# Altium schematic sheet ESP_SCH.SchDoc
size 840 x 594 mm; SheetNumber: 1; SheetTotal: 1; PageSetup: Record=PageOptions|CenterHorizontal=False|CenterVertical=False|PrintScale=0.33|XCorrection=0.00|YCorrection=0.00|PrintKind=1|BorderSize=5000000|LeftOffset=0|BottomOffset=0|Orientation=2|PaperLength=1000|PaperWidth=1000|Scale=100|PaperSource=15|PrintQuality=600|MediaType=1|DitherType=10|PrintScaleMode=1|PaperKind=Letter|PaperIndex=1; ЕСКД: 2.104-2006
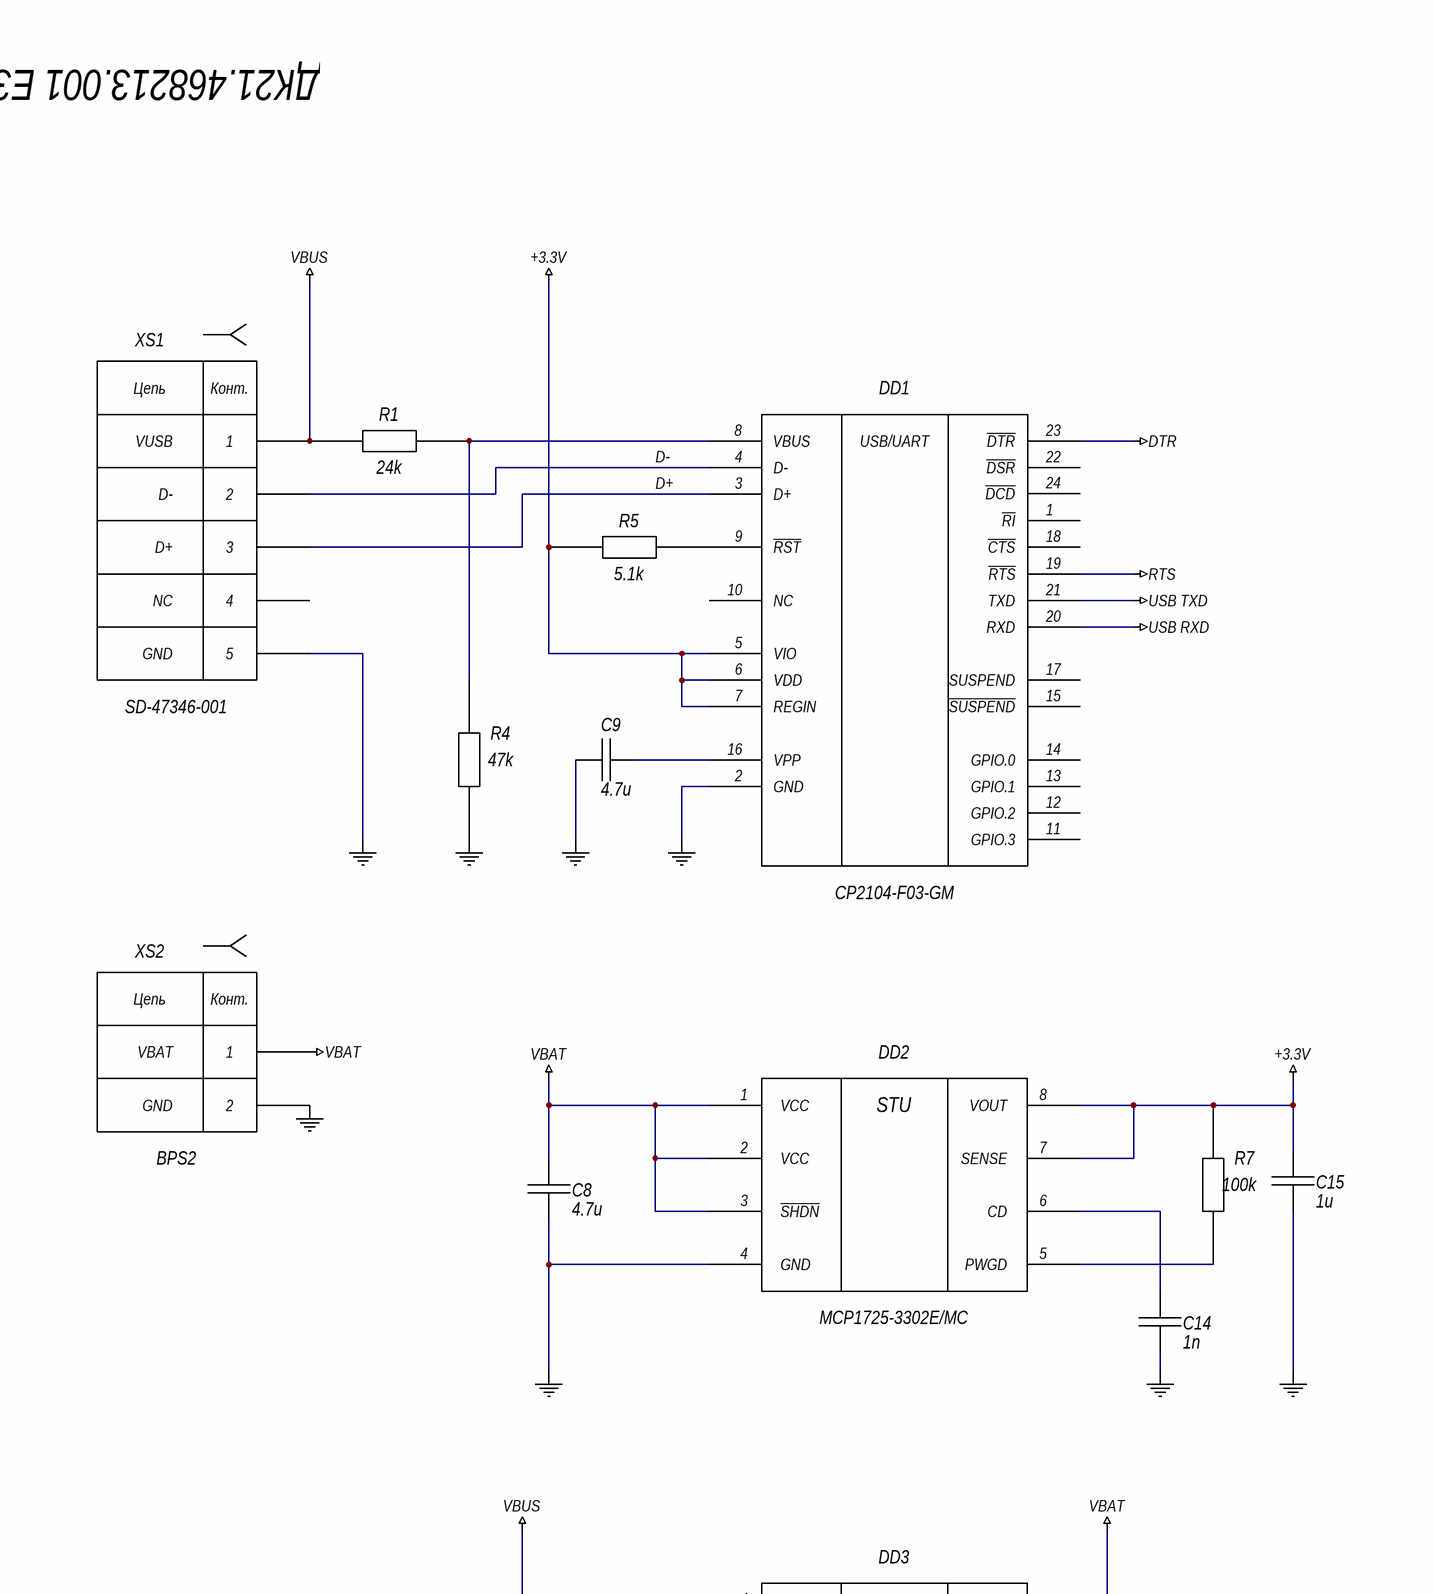
[diagram p0: ESP_SCH.SchDoc, top left]
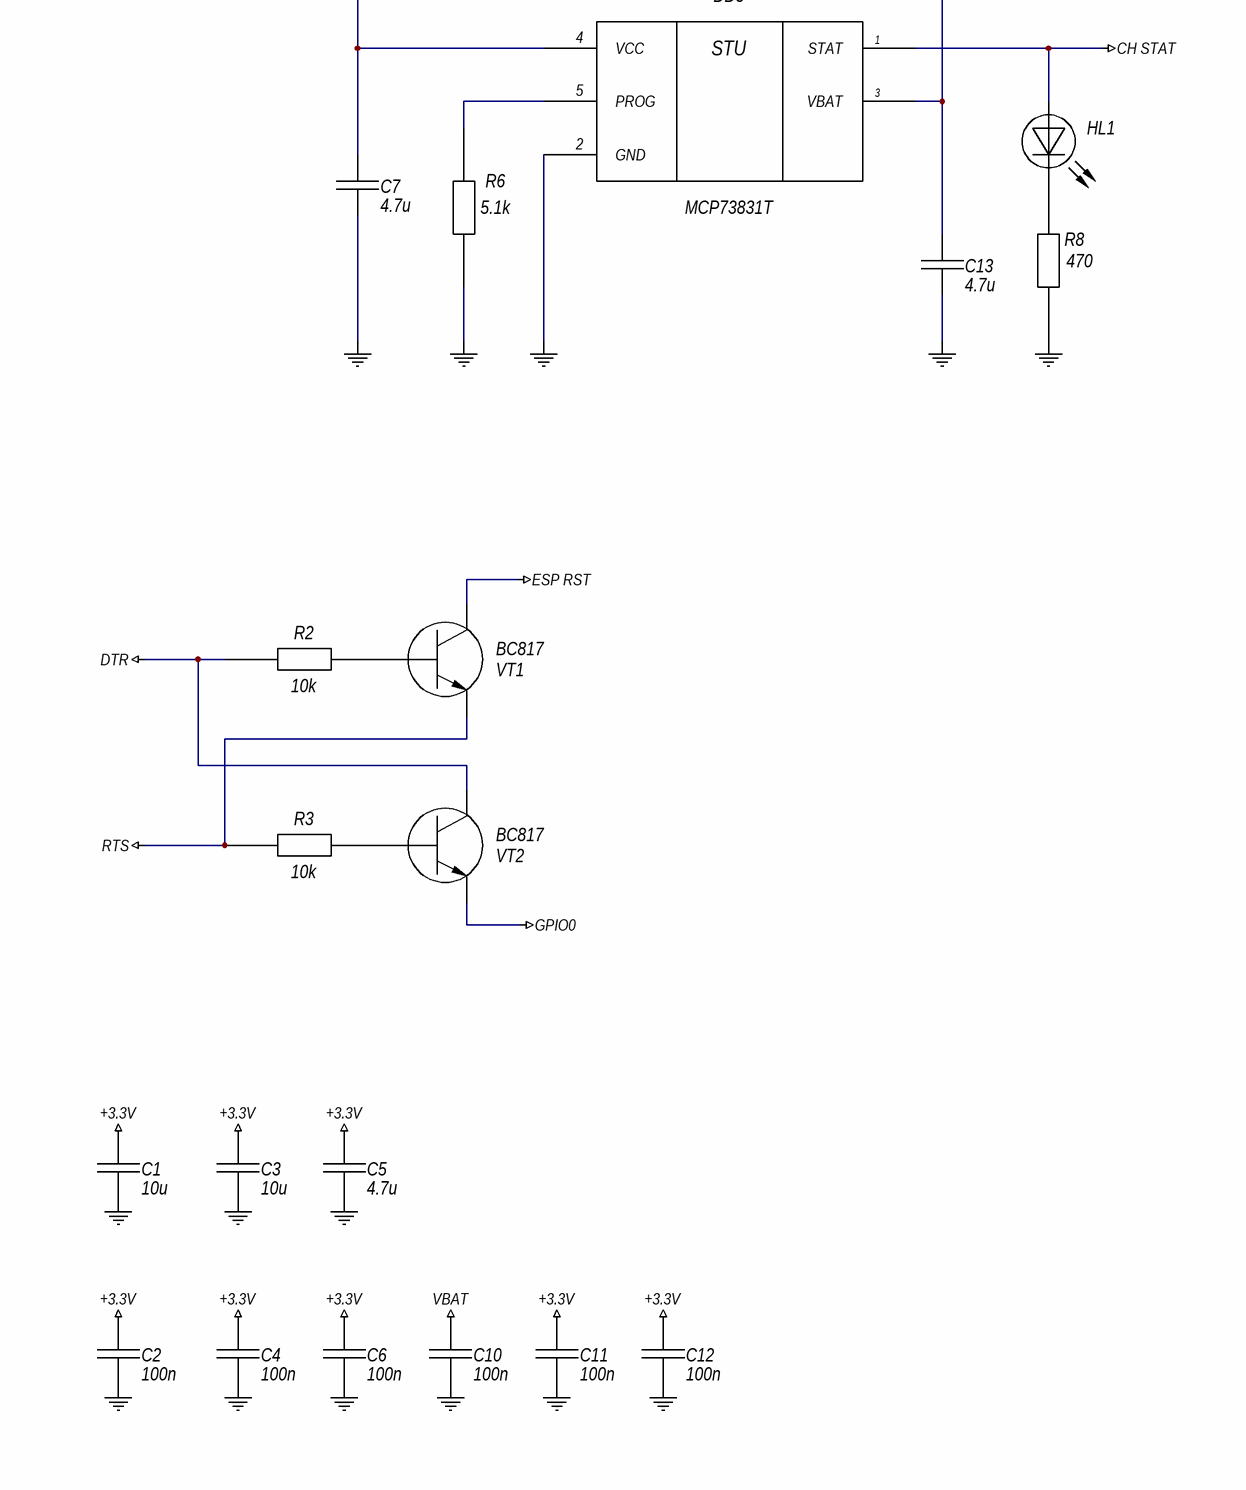
[diagram p1: ESP_SCH.SchDoc, bottom left]
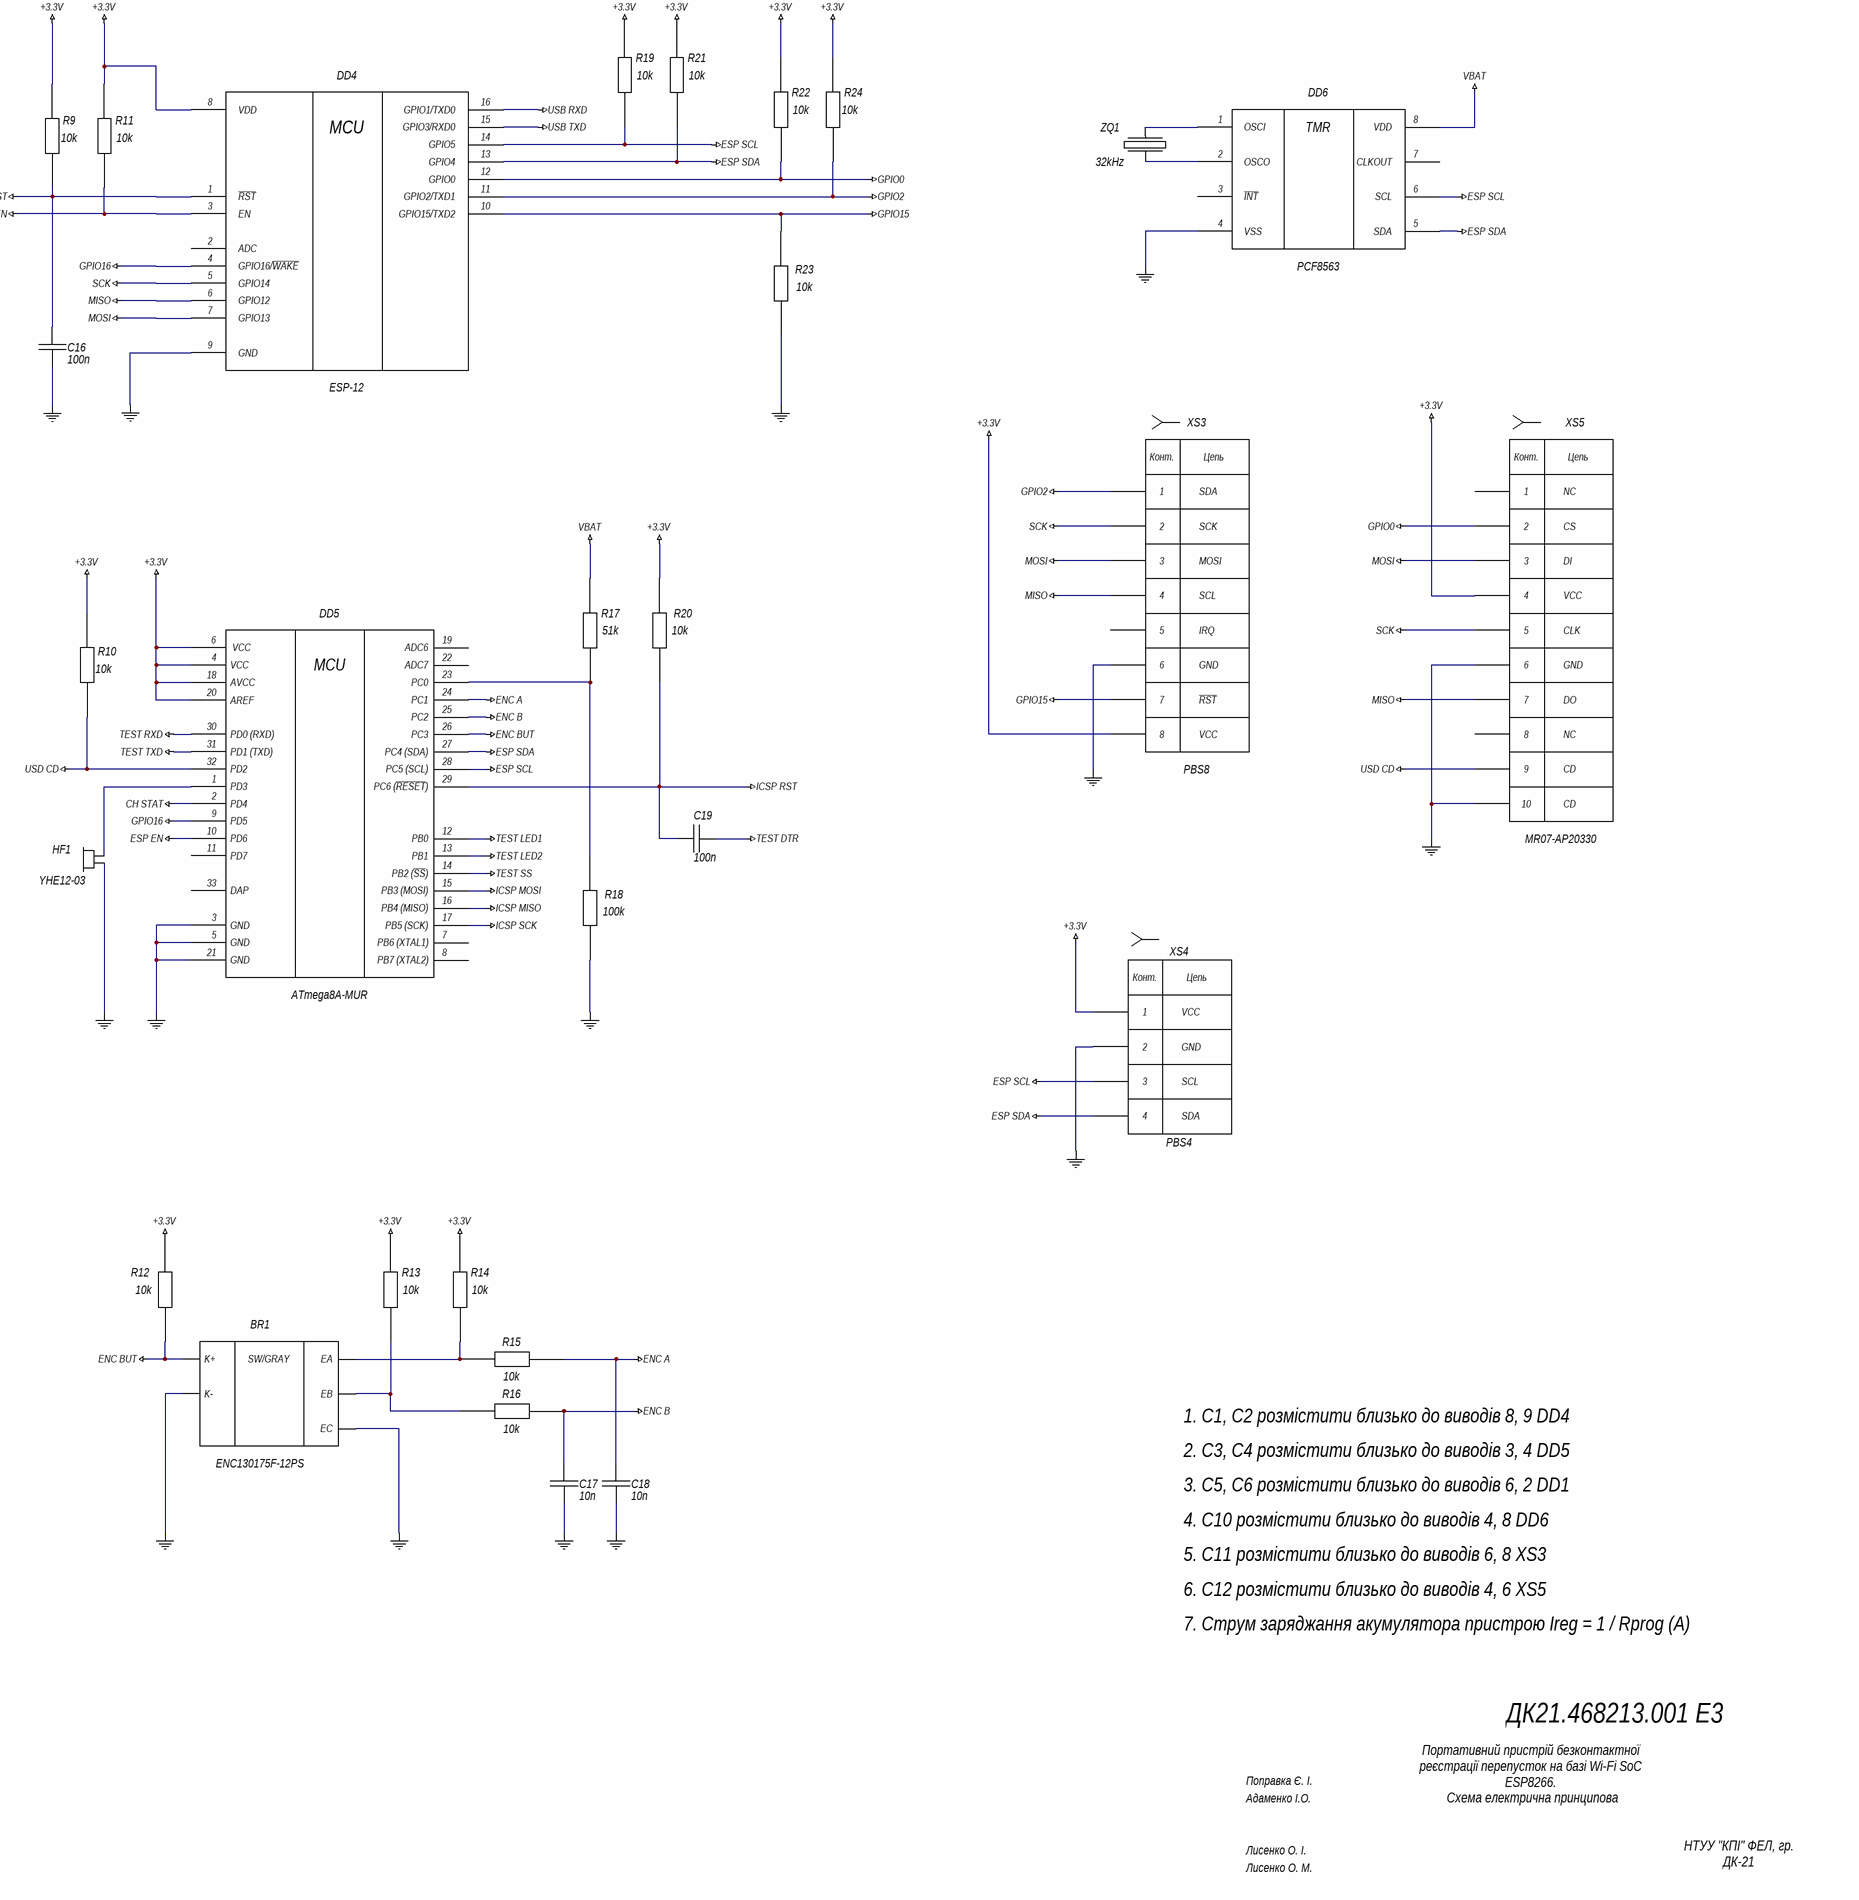
[diagram p2: ESP_SCH.SchDoc, bottom right]

## Parts
BR1  ENC130175F-12PS  [ENCODER_LED_2]
C1  value 10u  [RES0603]  (hidden comment: C0805)
C2  value 100n  [RES0603]  (hidden comment: C0805)
C3  value 10u  [RES0603]  (hidden comment: C0805)
C4  value 100n  [RES0603]  (hidden comment: C0805)
C5  value 4.7u  [RES0603]  (hidden comment: C0805)
C6  value 100n  [RES0603]  (hidden comment: C0805)
C7  value 4.7u  [RES0603]  (hidden comment: C0805)
C8  value 4.7u  [RES0603]  (hidden comment: C0805)
C9  value 4.7u  [RES0603]  (hidden comment: C0805)
C10  value 100n  [RES0603]  (hidden comment: C0805)
C11  value 100n  [RES0603]  (hidden comment: C0805)
C12  value 100n  [RES0603]  (hidden comment: C0805)
C13  value 4.7u  [RES0603]  (hidden comment: C0805)
C14  value 1n  [RES0603]  (hidden comment: C0805)
C15  value 1u  [RES0603]  (hidden comment: C0805)
C16  value 100n  [RES0603]  (hidden comment: C0805)
C17  value 10n  [RES0603]  (hidden comment: C0805)
C18  value 10n  [RES0603]  (hidden comment: C0805)
C19  value 100n  [RES0603]  (hidden comment: C0805)
DD1  CP2104-F03-GM  [SLAB-QFN-24-2675x2675TP_M]
DD2  MCP1725-3302E/MC  [SOIC127P600X175-8N]
DD3  MCP73831T  [SOT95P270X145-5N]
DD4  ESP-12  [ESP_12_E]
DD5  ATmega8A-MUR  [QFN127P600-8N]
DD6  PCF8563  [SOIC8]
HF1  YHE12-03  [PCBComponent_1]
HL1  (no value)  [RES0603]
R1  value 24k  [RES0603]  (hidden comment: R0805)
R2  value 10k  [RES0603]  (hidden comment: R0805)
R3  value 10k  [RES0603]  (hidden comment: R0805)
R4  value 47k  [RES0603]  (hidden comment: R0805)
R5  value 5.1k  [RES0603]  (hidden comment: R0805)
R6  value 5.1k  [RES0603]  (hidden comment: R0805)
R7  value 100k  [RES0603]  (hidden comment: R0805)
R8  value 470  [RES0603]  (hidden comment: R0805)
R9  value 10k  [RES0603]  (hidden comment: R0805)
R10  value 10k  [RES0603]  (hidden comment: R0805)
R11  value 10k  [RES0603]  (hidden comment: R0805)
R12  value 10k  [RES0603]  (hidden comment: R0805)
R13  value 10k  [RES0603]  (hidden comment: R0805)
R14  value 10k  [RES0603]  (hidden comment: R0805)
R15  value 10k  [RES0603]  (hidden comment: R0805)
R16  value 10k  [RES0603]  (hidden comment: R0805)
R17  value 51k  [RES0603]  (hidden comment: R0805)
R18  value 100k  [RES0603]  (hidden comment: R0805)
R19  value 10k  [RES0603]  (hidden comment: R0805)
R20  value 10k  [RES0603]  (hidden comment: R0805)
R21  value 10k  [RES0603]  (hidden comment: R0805)
R22  value 10k  [RES0603]  (hidden comment: R0805)
R23  value 10k  [RES0603]  (hidden comment: R0805)
R24  value 10k  [RES0603]  (hidden comment: R0805)
VT1  BC817  [SOT95P245X110-3N]
VT2  BC817  [SOT95P245X110-3N]
XS1  SD-47346-001  [USB-MICROB]
XS2  BPS2  [PCBComponent_1 - duplicate]
XS3  PBS8  [RFID-RC522]
XS4  PBS4  [SSD]
XS5  MR07-AP20330  [MICROSD Slot]
ZQ1  32kHz  [PCBComponent_1 - duplicate1]

## Nets
+3.3V: C1.1 C2.1 C3.1 C4.1 C5.1 C6.1 C11.1 C12.1 C15.1 DD1.5(VIO) DD1.6(VDD) DD1.7(REGIN) DD2.7(SENSE) DD2.8(VOUT) DD4.8(VDD) DD5.4(VCC) DD5.6(VCC) DD5.18(AVCC) DD5.20(AREF) R5.1(Terminal_A) R7.2(Terminal_B) R9.2(Terminal_B) R10.2(Terminal_B) R11.2(Terminal_B) R12.2(Terminal_B) R13.2(Terminal_B) R14.2(Terminal_B) R19.2(Terminal_B) R20.2(Terminal_B) R21.2(Terminal_B) R22.2(Terminal_B) R24.2(Terminal_B) XS3.8(VCC) XS4.1(VCC) XS5.4(VCC)
CH STAT: DD3.1(STAT) DD5.2(PD4) HL1.1(A)
DTR: DD1.23(~{DTR}) R2.2(Terminal_B) VT2.3(K)
ENC A: C18.1 DD5.24(PC1) R15.2(Terminal_B)
ENC B: C17.1 DD5.25(PC2) R16.2(Terminal_B)
ENC BUT: BR1.K+ DD5.26(PC3) R12.1(Terminal_A)
ESP EN: DD4.3(EN) DD5.10(PD6) R11.1(Terminal_A)
ESP RST: C16.1 DD4.1(~{RST}) R9.1(Terminal_A) VT1.3(K)
ESP SCL: DD4.14(GPIO5) DD5.28(PC5_(SCL)) DD6.6(SCL) R19.1(Terminal_A) XS4.3(SCL)
ESP SDA: DD4.13(GPIO4) DD5.27(PC4_(SDA)) DD6.5(SDA) R21.1(Terminal_A) XS4.4(SDA)
GND: BR1.EC BR1.K- C1.2 C2.2 C3.2 C4.2 C5.2 C6.2 C7.2 C8.2 C9.2 C10.2 C11.2 C12.2 C13.2 C14.2 C15.2 C16.2 C17.2 C18.2 DD1.2(GND) DD2.4(GND) DD3.2(GND) DD4.9(GND) DD5.3(GND) DD5.5(GND) DD5.21(GND) DD6.4(VSS) HF1.1(Terminal_A) R4.1(Terminal_A) R6.1(Terminal_A) R8.1(Terminal_A) R18.1(Terminal_A) R23.1(Terminal_A) XS1.5(GND) XS2.2(GND) XS3.6(GND) XS4.2(GND) XS5.6(GND) XS5.10(CD)
GPIO0: DD4.12(GPIO0) R22.1(Terminal_A) VT2.2(E) XS5.2(CS)
GPIO2: DD4.11(GPIO2/TXD1) R24.1(Terminal_A) XS3.1(SDA)
GPIO15: DD4.10(GPIO15/TXD2) R23.2(Terminal_B) XS3.7(~{RST})
GPIO16: DD4.4(GPIO16/~{WAKE}) DD5.9(PD5)
ICSP MISO: DD5.16(PB4_(MISO))
ICSP MOSI: DD5.15(PB3_(MOSI))
ICSP RST: C19.1 DD5.29(PC6_(~{RESET})) R20.1(Terminal_A)
ICSP SCK: DD5.17(PB5_(SCK))
MISO: DD4.6(GPIO12) XS3.4(SCL) XS5.7(DO)
MOSI: DD4.7(GPIO13) XS3.3(MOSI) XS5.3(DI)
RTS: DD1.19(~{RTS}) R3.2(Terminal_B) VT1.2(E)
SCK: DD4.5(GPIO14) XS3.2(SCK) XS5.5(CLK)
TEST DTR: C19.2
TEST LED1: DD5.12(PB0)
TEST LED2: DD5.13(PB1)
TEST RXD: DD5.30(PD0_(RXD))
TEST SS: DD5.14(PB2_(~{SS}))
TEST TXD: DD5.31(PD1_(TXD))
USB RXD: DD1.20(RXD) DD4.16(GPIO1/TXD0)
USB TXD: DD1.21(TXD) DD4.15(GPIO3/RXD0)
USD CD: DD5.32(PD2) R10.1(Terminal_A) XS5.9(CD)
VBAT: C8.1 C10.1 C13.1 DD2.1(VCC) DD2.2(VCC) DD2.3(~{SHDN}) DD3.3(VBAT) DD6.8(VDD) R17.2(Terminal_B) XS2.1(VBAT)
VBUS: C7.1 DD3.4(VCC) R1.2(Terminal_B) XS1.1(VUSB)
D+: DD1.3(D+) XS1.3(D+)
D-: DD1.4(D-) XS1.2(D-)
NetBR1_EA: BR1.EA R14.1(Terminal_A) R15.1(Terminal_A)
NetBR1_EB: BR1.EB R13.1(Terminal_A) R16.1(Terminal_A)
NetC9_1: C9.1 DD1.16(VPP)
NetC14_1: C14.1 DD2.6(CD)
NetDD1_8: DD1.8(VBUS) R1.1(Terminal_A) R4.2(Terminal_B)
NetDD1_9: DD1.9(~{RST}) R5.2(Terminal_B)
NetDD2_5: DD2.5(PWGD) R7.1(Terminal_A)
NetDD3_5: DD3.5(PROG) R6.2(Terminal_B)
NetDD5_1: DD5.1(PD3) HF1.2(Terminal_B)
NetDD5_23: DD5.23(PC0) R17.1(Terminal_A) R18.2(Terminal_B)
NetDD6_1: DD6.1(OSCI) ZQ1.1
NetDD6_2: DD6.2(OSCO) ZQ1.2
NetHL1_2: HL1.2(K) R8.2(Terminal_B)
NetR2_1: R2.1(Terminal_A) VT1.1(B)
NetR3_1: R3.1(Terminal_A) VT2.1(B)

Not connected (* = marked no-connect by the designer): DD1 1(~{RI}) 10(NC) 11(GPIO.3) 12(GPIO.2) 13(GPIO.1) 14(GPIO.0) 15(~{SUSPEND}) 17(SUSPEND) 18(~{CTS}) 22(~{DSR}) 24(~{DCD}); DD4 2(ADC); DD5 7(PB6_(XTAL1)) 8(PB7_(XTAL2)) 11(PD7) 19(ADC6) 22(ADC7) 33(DAP); DD6 3(~{INT}) 7(CLKOUT); XS1 4(NC); XS3 5(IRQ); XS5 1(NC) 8(NC)

## Notes on the sheet
- ДК21.468213.001 Е3
- 1. C1, C2 розмістити близько до виводів 8, 9 DD4
- 2. C3, C4 розмістити близько до виводів 3, 4 DD5
- 3. C5, C6 розмістити близько до виводів 6, 2 DD1
- 4. C10 розмістити близько до виводів 4, 8 DD6
- 5. C11 розмістити близько до виводів 6, 8 XS3
- 6. C12 розмістити близько до виводів 4, 6 XS5
- 7. Струм заряджання акумулятора пристрою Ireg = 1 / Rprog (A)
- Поправка Є. І.
- Адаменко І.О.
- Портативний пристрій безконтактної реєстрації перепусток на базі Wi-Fi SoC ESP8266.
  Схема електрична принципова
- Лисенко О. І.
- НТУУ "КПІ" ФЕЛ, гр. ДК-21
- Лисенко О. М.
- Подп. и дата
- Инв. № дубл.
- Взам. инв. №
- Изм.
- Разраб.
- Лист
- № докум.
- Подп.
- Дата
- Лит.
- Масса
- Масштаб
- Пров.
- Т.контр.
- Листов
- Утв.
- Н.контр.
- Инв. № подл.
- Копировал
- Формат А1
- (in symbol ATmega8A-MUR) MCU
- (in symbol CP2104-F03-GM) USB/UART
- (in symbol ENC130175F-12PS) SW/GRAY
- (in symbol ESP-12E) MCU
- (in symbol lipo) Цепь; Конт.
- (in symbol MCP1725-3302E/MC) STU
- (in symbol MCP73831T) STU
- (in symbol PCF8563) TMR
- (in symbol RC522) Конт.; Цепь
- (in symbol SSD1306) Конт.; Цепь
- (in symbol usb) Цепь; Конт.
- (in symbol uSD) Конт.; Цепь

## Library data of the parts
C1-C19 = C0805: Chip capasitor; Manufacter: MURATA; Part Number: GRJ32ER71H475KE11; Voltage: 50V; Tolerance: ±5%; Rem: SMD 0805
DD1 = CP2104-F03-GM: Single-Chip USB to UART Bridge, 4 Dig I/O Pins, Internal Oscillator, 1024 Bytes EEPROM, -40 to 85 degC, 24-pin QFN; Manufacturer: Silicon Labs; Internal Oscillator: TRUE; Sub-Family: USB Bridges; DatasheetVersion: Rev. 1.0; PackageReference: QFN-24; PackageDescription: 24-Pin Quad-Flat No-Leads Package, Body 4 x 4 mm, Pitch 0.5 mm; Supplier 1: Digi-Key; Supplier Part Number 1: 336-2008-5-ND; Supplier 2: Mouser; Supplier Part Number 2: 634-CP2104-F03-GM; EEPROM: 1024 Bytes; Mounting Technology: Surface Mount; Code_JEDEC: MO-220; Code_IPC: J-STD-020; PartNumber: CP2104-F03-GM; ComponentLink1Description: Manufacturer URL; ComponentLink1URL: http://www.silabs.com/; ComponentLink2Description: Datasheet; ComponentLink2URL: http://www.silabs.com/Support%20Documents/TechnicalDocs/cp2104.pdf; ComponentLink3Description: Package Specification; ComponentLink3URL: http://www.silabs.com/Support%20Documents/TechnicalDocs/C8051F93x-92x.pdf
DD2 = MCP1725-3302E/MC: MCP1725-3302E/MC ULDO; Manufacter: Microchip; Part Number: MCP1725-3302E/MC
DD3 = MCP73831T: MCP73831T Li-ion/Li-po charger; Manufacter: Microchip; Part Number: MCP73831/2  SOT-23-5
DD4 = ESP-12E: ESP-12 Wi-Fi Module; IC: ESP8266-EX; Vendor: Ai-thinker
DD5 = ATmega8A-MUR: 8-bit AVR Microcontroller, 2.7-5.5V, 16MHz, 8KB Flash, 512 Bytes EEPROM, 1KB SRAM, 33-pin MLF, Industrial Grade (-40°C to 85°C), Reel; DatasheetVersion: revD, Feb-2011; PackageVersion: revE, May-2006; PackageReference: 32M1-A; PackageDescription: 32-Pin Micro Lead Frame Package (MLF),  5 x 5 x 1.0 mm Body, Pitch 0.50 mm, 3.10mm Exposed Pad; Code_JEDEC: MO-220-VHHD-2; ComponentLink1Description: Manufacturer URL; ComponentLink1URL: http://www.atmel.com/; ComponentLink2Description: ATmega8A Datasheet; ComponentLink2URL: http://www.atmel.com/dyn/resources/prod_documents/doc8159.pdf; ComponentLink3Description: ATmega8A Summary; ComponentLink3URL: http://www.atmel.com/dyn/resources/prod_documents/8159S.pdf
DD6 = PCF8563: Manufacter: Microchip; Part Number: MCP1725-3302E/MC
HF1 = HF: Пьезоизлучатель; ЕСКД: ГОСТ 2.747-68; Manufacturer: *
HL1 = HL_02: Светодиод; Manufacter: Kingbright; Part Number: KP-2012VGC-A
R1-R24 = R0805: Резистор; Manufacter: YAGEO; Part Number: RC0805JR-070RL; Voltage: 150V; Tolerance: ±5%
VT1 VT2 = VT_01: Транзистор биполярный, NPN; ЕСКД: ГОСТ 2.730-73; Manufacturer: *
XS1 = usb: micro USB; Manufacter: NXP; Part Number: RFID-RC522 MFRC522 модуль
XS2 = lipo: battery; Manufacter: NXP; Part Number: RFID-RC522 MFRC522 модуль
XS3 = RC522: RC522 RFID module; Manufacter: NXP; Part Number: RFID-RC522 MFRC522 модуль
XS4 = SSD1306: SSD1306 OLED Screen Module; Manufacter: NXP; Part Number: RFID-RC522 MFRC522 модуль
XS5 = uSD: RC522 RFID module; Manufacter: NXP; Part Number: RFID-RC522 MFRC522 модуль
ZQ1 = ZQ_01: Элемент пьезоэлектрический с двумя выводами; Manufacter: CITIZEN; Part Number: HC49/US 16MHz